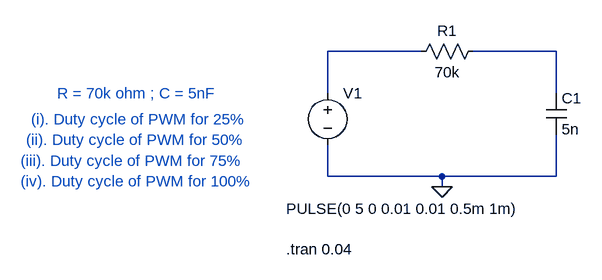
[diagram p0: schematic Draft2.asc]
Draft2.asc, the LTspice schematic file:
Version 4
SHEET 1 880 680
WIRE 160 64 16 64
WIRE 368 64 240 64
WIRE 16 128 16 64
WIRE 368 128 368 64
WIRE 16 256 16 208
WIRE 192 256 16 256
WIRE 368 256 368 192
WIRE 368 256 192 256
WIRE 192 272 192 256
FLAG 192 272 0
SYMBOL voltage 16 112 R0
WINDOW 3 -64 194 Left 2
WINDOW 123 0 0 Left 0
WINDOW 39 0 0 Left 0
SYMATTR Value PULSE(0 5 0 0.01 0.01 0.5m 1m)
SYMATTR InstName V1
SYMBOL cap 352 128 R0
SYMATTR InstName C1
SYMATTR Value 5n
SYMBOL res 256 48 R90
WINDOW 0 0 56 VBottom 2
WINDOW 3 32 56 VTop 2
SYMATTR InstName R1
SYMATTR Value 70k
TEXT -48 368 Left 2 !.tran 0.04
TEXT -400 128 Left 2 ;R = 70k ohm ; C = 5nF
TEXT -440 168 Left 2 ;(i). Duty cycle of PWM for 25%
TEXT -448 200 Left 2 ;(ii). Duty cycle of PWM for 50%
TEXT -456 232 Left 2 ;(iii). Duty cycle of PWM for 75%
TEXT -456 264 Left 2 ;(iv). Duty cycle of PWM for 100%

The netlist it stands for:
* Draft2.asc
V1 N001 0 PULSE(0 5 0 0.01 0.01 0.5m 1m)
C1 N002 0 5n
R1 N002 N001 70k
.tran 0.04
* R = 70k ohm ; C = 5nF
* (i). Duty cycle of PWM for 25%
* (ii). Duty cycle of PWM for 50%
* (iii). Duty cycle of PWM for 75%
* (iv). Duty cycle of PWM for 100%
.backanno
.end